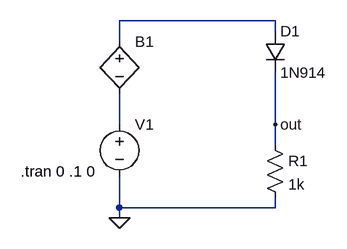
[diagram p0: schematic circuito2.asc]
circuito2.asc, the LTspice schematic file:
Version 4
SHEET 1 880 680
WIRE 304 -16 64 -16
WIRE 304 0 304 -16
WIRE 64 16 64 -16
WIRE 64 144 64 96
WIRE 304 144 304 64
WIRE 304 176 304 144
WIRE 64 272 64 224
WIRE 304 272 304 256
WIRE 304 272 64 272
WIRE 64 288 64 272
FLAG 64 288 0
FLAG 304 144 out
SYMBOL voltage 64 128 R0
WINDOW 123 0 0 Left 0
WINDOW 3 24 96 Invisible 2
SYMATTR SpiceLine Rser=50
SYMATTR InstName V1
SYMATTR Value SINE(0.59 0.2 1k)
SYMBOL diode 288 0 R0
SYMATTR InstName D1
SYMATTR Value 1N914
SYMBOL res 288 160 R0
SYMATTR InstName R1
SYMATTR Value 1k
SYMBOL bv 64 0 R0
WINDOW 3 24 96 Invisible 2
SYMATTR InstName B1
SYMATTR Value V=white(-1e3*time)/10 + white(1e3*time)/10
TEXT -88 216 Left 2 !.tran 0 .1 0

The netlist it stands for:
* circuito2.asc
V1 N002 0 SINE(0.59 0.2 1k) Rser=50
D1 N001 out 1N914
R1 out 0 1k
B1 N001 N002 V=white(-1e3*time)/10 + white(1e3*time)/10
.model D D
.lib standard.dio
.tran 0 .1 0
.backanno
.end